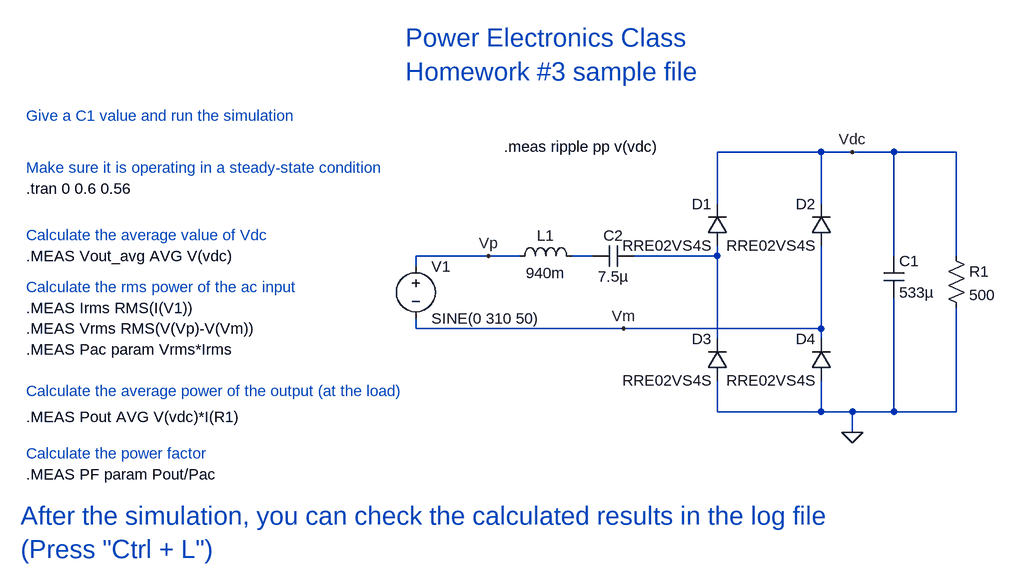
[diagram p0: schematic HW3_Full_Bridge_Rectifier.asc]
HW3_Full_Bridge_Rectifier.asc, the LTspice schematic file:
Version 4
SHEET 1 1256 680
WIRE 224 -272 64 -272
WIRE 272 -272 224 -272
WIRE 336 -272 272 -272
WIRE 432 -272 336 -272
WIRE 64 -192 64 -272
WIRE 224 -192 224 -272
WIRE -288 -112 -400 -112
WIRE -240 -112 -288 -112
WIRE -128 -112 -160 -112
WIRE 64 -112 64 -128
WIRE 64 -112 -64 -112
WIRE 336 -112 336 -272
WIRE 432 -112 432 -272
WIRE -400 -96 -400 -112
WIRE -400 0 -400 -16
WIRE -80 0 -400 0
WIRE 224 0 224 -128
WIRE 224 0 -80 0
WIRE 64 16 64 -112
WIRE 224 16 224 0
WIRE 64 128 64 80
WIRE 224 128 224 80
WIRE 224 128 64 128
WIRE 272 128 224 128
WIRE 336 128 336 -48
WIRE 336 128 272 128
WIRE 432 128 432 -32
WIRE 432 128 336 128
WIRE 272 160 272 128
FLAG 272 160 0
FLAG 272 -272 Vdc
FLAG -288 -112 Vp
FLAG -80 0 Vm
SYMBOL diode 80 -128 R180
WINDOW 0 24 64 Left 2
WINDOW 3 24 0 Left 2
SYMATTR InstName D1
SYMATTR Value RRE02VS4S
SYMBOL diode 240 -128 R180
WINDOW 0 24 64 Left 2
WINDOW 3 24 0 Left 2
SYMATTR InstName D2
SYMATTR Value RRE02VS4S
SYMBOL diode 80 80 R180
WINDOW 0 24 64 Left 2
WINDOW 3 24 0 Left 2
SYMATTR InstName D3
SYMATTR Value RRE02VS4S
SYMBOL diode 240 80 R180
WINDOW 0 24 64 Left 2
WINDOW 3 24 0 Left 2
SYMATTR InstName D4
SYMATTR Value RRE02VS4S
SYMBOL voltage -400 -112 R0
WINDOW 123 0 0 Left 0
WINDOW 39 0 0 Left 0
SYMATTR InstName V1
SYMATTR Value SINE(0 310 50)
SYMBOL res 416 -128 R0
SYMATTR InstName R1
SYMATTR Value 500
SYMBOL cap 320 -112 R0
SYMATTR InstName C1
SYMATTR Value 533µ
SYMBOL ind -256 -96 R270
WINDOW 0 32 56 VTop 2
WINDOW 3 5 56 VBottom 2
SYMATTR InstName L1
SYMATTR Value 940m
SYMBOL cap -64 -128 R90
WINDOW 0 0 32 VBottom 2
WINDOW 3 32 32 VTop 2
SYMATTR InstName C2
SYMATTR Value 7.5µ
TEXT -1000 -216 Left 2 !.tran 0 0.6 0.56
TEXT -1000 -32 Left 2 !.MEAS Irms RMS(I(V1))
TEXT -1000 32 Left 2 !.MEAS Pac param Vrms*Irms
TEXT -1000 0 Left 2 !.MEAS Vrms RMS(V(Vp)-V(Vm))
TEXT -1000 136 Left 2 !.MEAS Pout AVG V(vdc)*I(R1)
TEXT -1000 224 Left 2 !.MEAS PF param Pout/Pac
TEXT -1000 -112 Left 2 !.MEAS Vout_avg AVG V(vdc)
TEXT -1000 -144 Left 2 ;Calculate the average value of Vdc
TEXT -1000 -64 Left 2 ;Calculate the rms power of the ac input
TEXT -1000 96 Left 2 ;Calculate the average power of the output (at the load)
TEXT -1000 192 Left 2 ;Calculate the power factor
TEXT -1008 288 Left 4 ;After the simulation, you can check the calculated results in the log file\n(Press "Ctrl + L")
TEXT -1000 -248 Left 2 ;Make sure it is operating in a steady-state condition
TEXT -416 -448 Left 4 ;Power Electronics Class\nHomework #3 sample file
TEXT -1000 -328 Left 2 ;Give a C1 value and run the simulation
TEXT -264 -280 Left 2 !.meas ripple pp v(vdc)

The netlist it stands for:
* HW3_Full_Bridge_Rectifier.asc
D1 N002 Vdc RRE02VS4S
D2 Vm Vdc RRE02VS4S
D3 0 N002 RRE02VS4S
D4 0 Vm RRE02VS4S
V1 Vp Vm SINE(0 310 50)
R1 Vdc 0 500
C1 Vdc 0 533µ
L1 Vp N001 940m
C2 N002 N001 7.5µ
.model D D
.lib standard.dio
.tran 0 0.6 0.56
.MEAS Irms RMS(I(V1))
.MEAS Pac param Vrms*Irms
.MEAS Vrms RMS(V(Vp)-V(Vm))
.MEAS Pout AVG V(vdc)*I(R1)
.MEAS PF param Pout/Pac
.MEAS Vout_avg AVG V(vdc)
* Calculate the average value of Vdc
* Calculate the rms power of the ac input
* Calculate the average power of the output (at the load)
* Calculate the power factor
* After the simulation, you can check the calculated results in the log file
* (Press "Ctrl + L")
* Make sure it is operating in a steady-state condition
* Power Electronics Class
* Homework #3 sample file
* Give a C1 value and run the simulation
.meas ripple pp v(vdc)
.backanno
.end

* Results of the author's LTspice run, read from the files saved beside the schematic
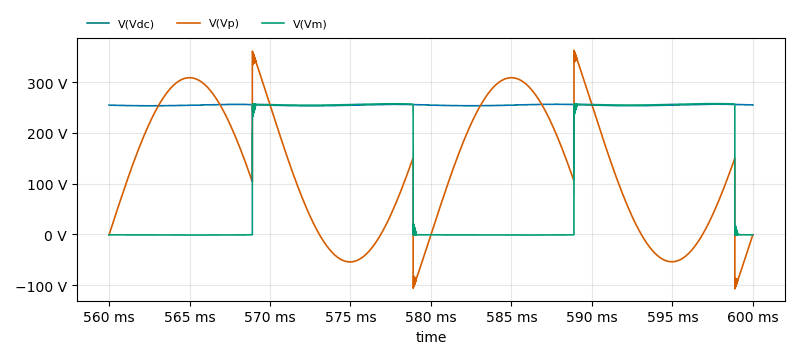
[diagram p1: Transient Analysis of HW3_Full_Bridge_Rectifier.asc, plotted from the saved traces]
* Transient Analysis, 1 run:
*   V(Vdc): min 253.4 V, max 256.5 V, average 254.8 V, rms 254.8 V, last 255 V
*   V(Vp): min -107.2 V, max 362.6 V, average 127.3 V, rms 181.8 V, last -858.6 mV
*   V(Vm): min -1.227 V, max 257.6 V, average 127.3 V, rms 180.8 V, last -858.6 mV
* From the log:
*   irms: RMS(i(v1))=0.615438 FROM 0 TO 0.04
*   pac: vrms*irms=134.878
*   vrms: RMS(v(vp)-v(vm))=219.157 FROM 0 TO 0.04
*   pout: AVG(v(vdc)*i(r1))=129.844 FROM 0 TO 0.04
*   pf: pout/pac=0.962682
*   vout_avg: AVG(v(vdc))=254.796 FROM 0 TO 0.04
*   ripple: PP(v(vdc))=3.18512 FROM 0 TO 0.04